# EasyEDA Pro project ProProject_ES120MC1 TO EPDIY 40P_2024-04-23.epro

# Schematic Schematic1
Create Date: 2024-03-15; Page Name: P1; Project Name: ES120MC1 TO EPDIY 40P; Schematic Name: Schematic1; Update Date: 2024-04-12; Company: 嘉立创EDA; Page Size: A4; Version: V1.0
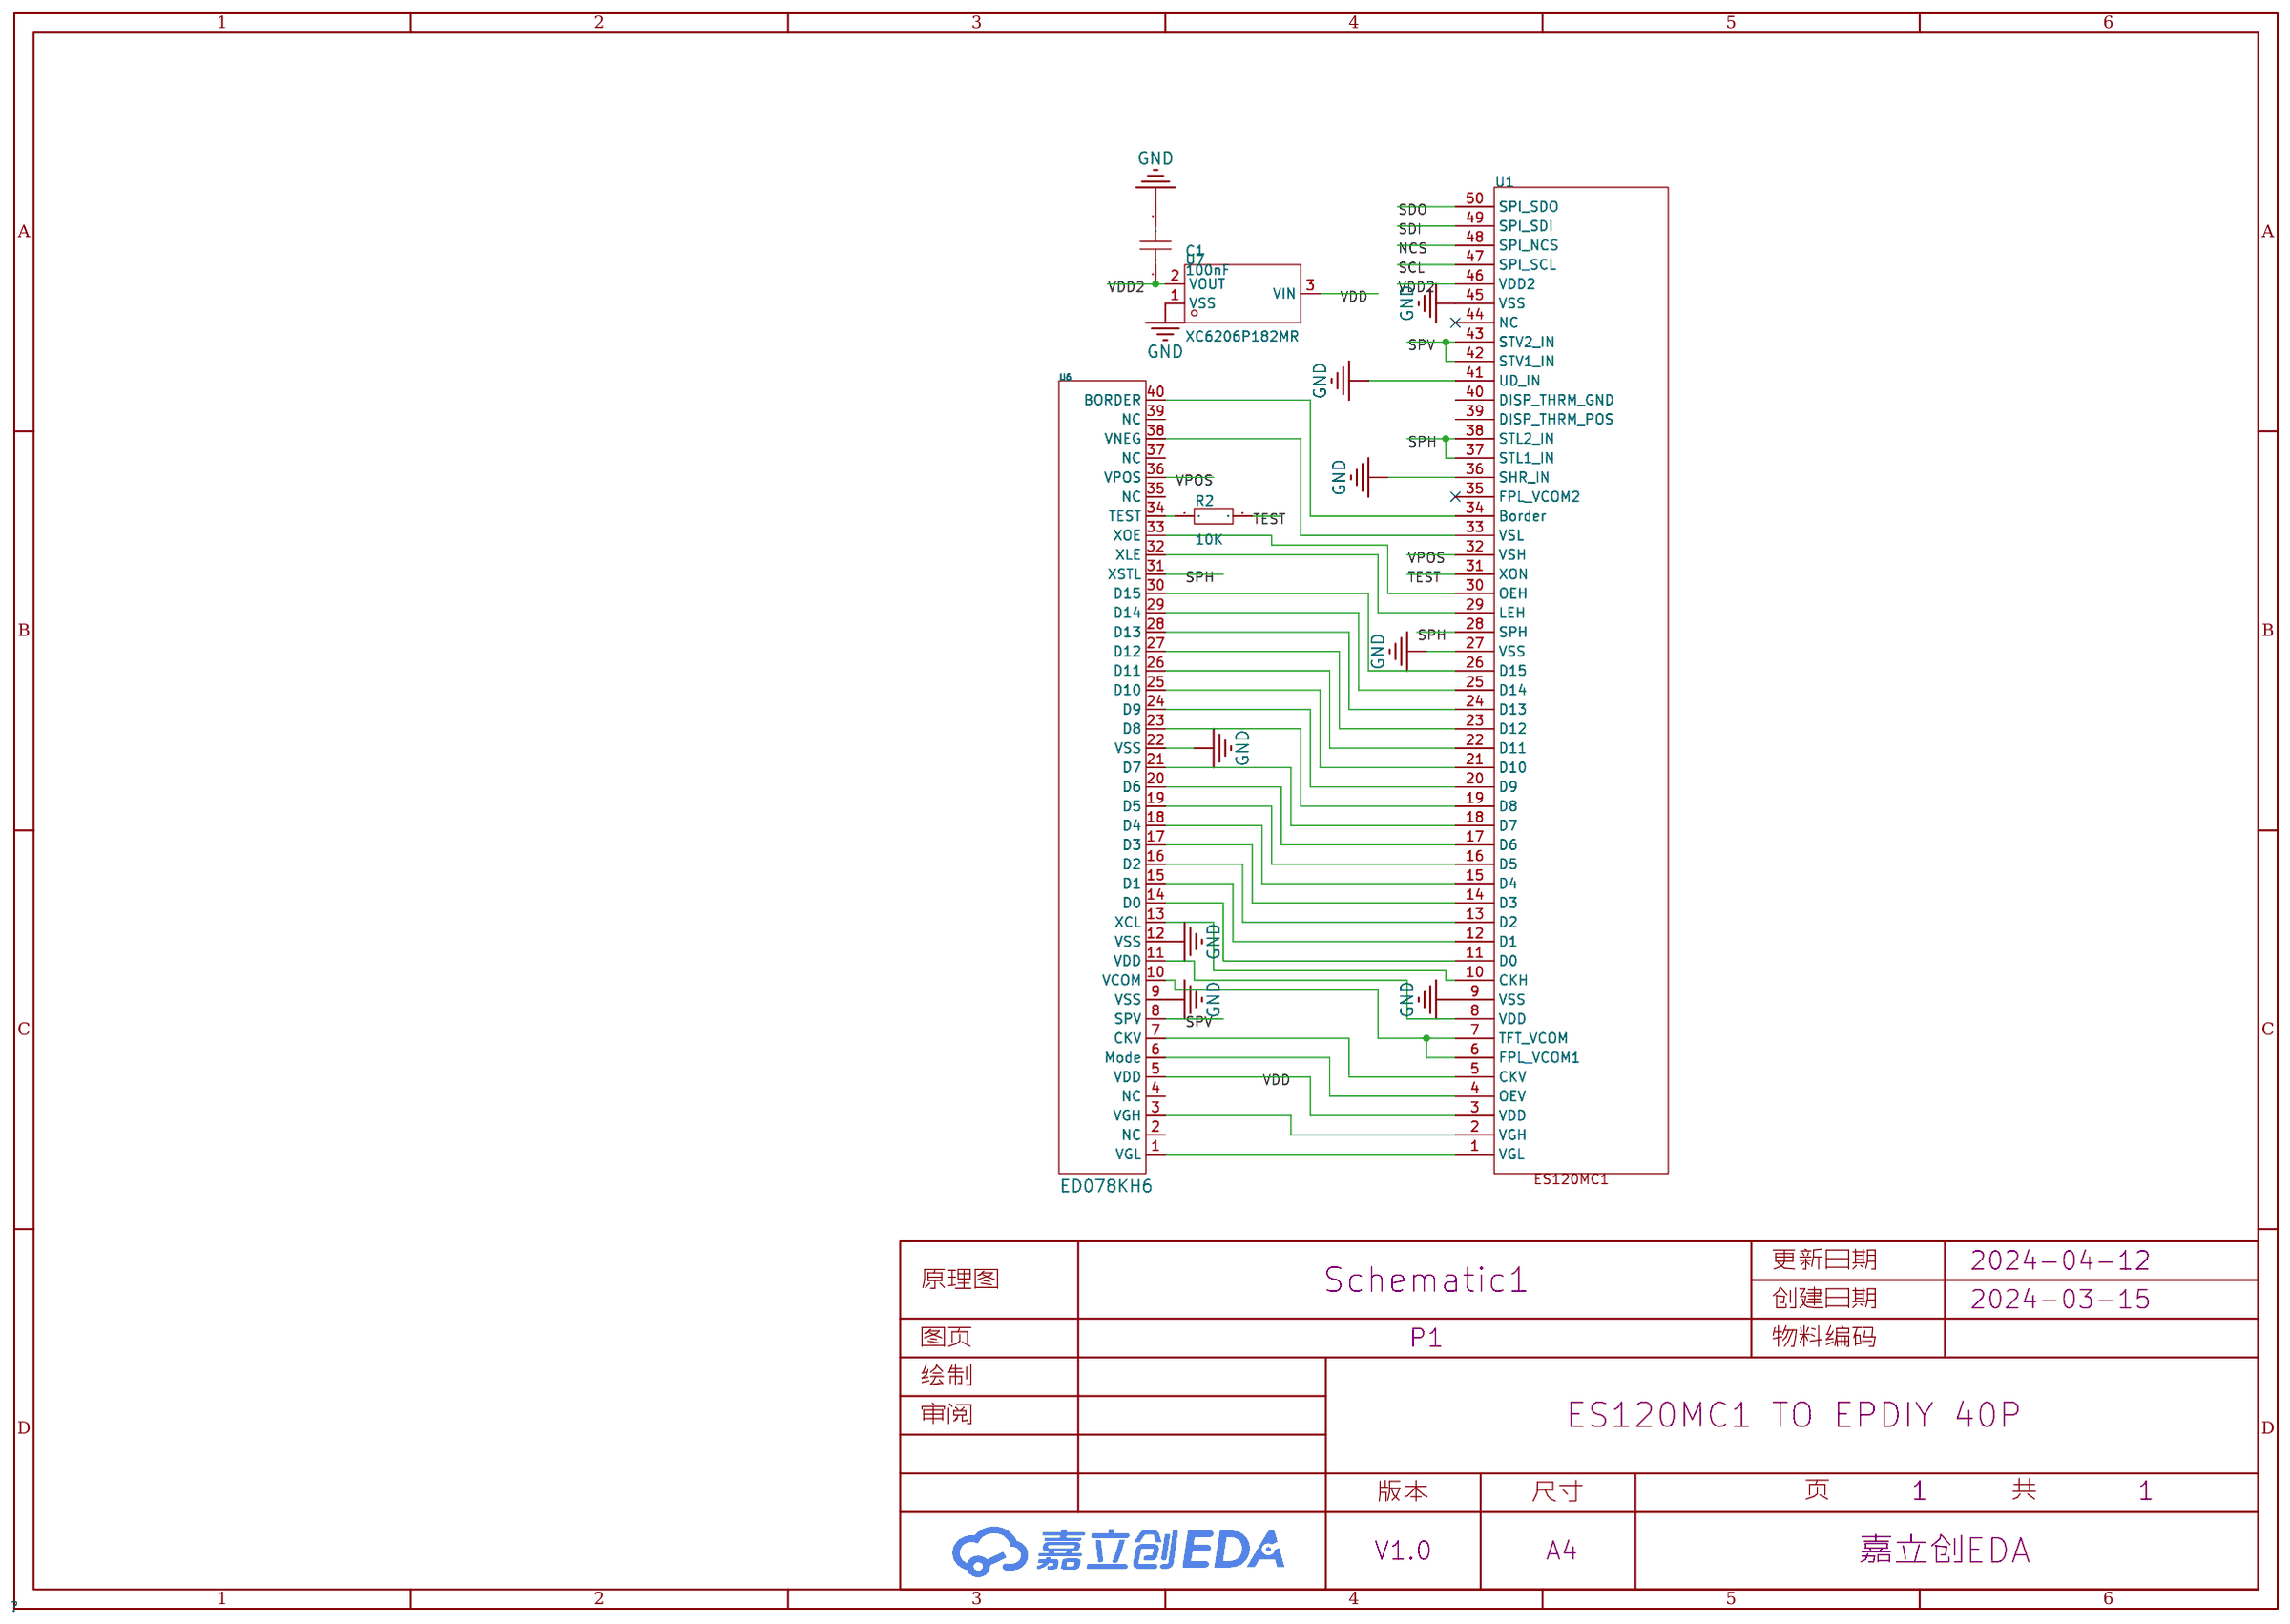
[diagram p0: schematic sheet]

## Parts
C1  100nF  [C0603]
R2  10K  [R0603]
U1  -  [FPC-SMD_FPC-0.5MM-50P]
U6  ED078KH6  [FPC-SMD_40P-P0.50_FG-H2.0-40P]
U7  XC6206P182MR  [SOT-23-3_L3.0-W1.7-P0.95-LS2.9-BR]

## Library data of the parts
C1 = CAP_0603: Supplier Footprint: 0603
R2 = Res_0603: Supplier Footprint: 0603
U1 = ES120MC1
U6 = epdiy_ED078KH6: LCSC: C202114
U7 = XC6206P182MR_C347373: 输出类型:固定;最大输入电压:8V;输出电压:1.8V;最大输出电流:250mA;电源纹波抑制比(PSRR):40dB@(1kHz);输出极性:正极;; LCSC Part Name: 输入8V 输出1.8V 250mA; Supplier Part: C347373; Manufacturer: UMW(友台半导体); Supplier Footprint: SOT-23; JLCPCB Part Class: 扩展库; Datasheet: https://atta.szlcsc.com/upload/public/pdf/source/20231109/6B10DA60E52FC900BF97E3EFEB5D6341.pdf; Supplier: LCSC; Output Type: 固定; Maximum Input Voltage: 8V; Output Voltage: 1.8V; MAX Output Current: 250mA; Power Supply Rejection Ratio (PSRR): 40dB@(1kHz); Dropout Voltage: 280mV@(50mA); Output Polarity: 正极; Number of Outputs: 1

## Nets
GND: C1.1 U1.9(VSS) U1.27(VSS) U1.36(SHR_IN) U1.41(UD_IN) U1.45(VSS) U6.9(VSS) U6.12(VSS) U6.22(VSS) U7.1(VSS)
VDD: U1.3(VDD) U6.5(VDD) U7.3(VIN)
VDD2: C1.2 U1.46(VDD2) U7.2(VOUT)
NCS: U1.48(SPI_NCS)
SCL: U1.47(SPI_SCL)
SDI: U1.49(SPI_SDI)
SDO: U1.50(SPI_SDO)
SPH: U1.28(SPH) U1.37(STL1_IN) U1.38(STL2_IN) U6.31(XSTL)
SPV: U1.42(STV1_IN) U1.43(STV2_IN) U6.8(SPV)
TEST: R2.2 U1.31(XON)
VPOS: U1.32(VSH) U6.36(VPOS)
$1N505: U1.1(VGL) U6.1(VGL)
$1N508: U1.2(VGH) U6.3(VGH)
$1N523: U1.5(CKV) U6.7(CKV)
$1N528: U1.11(D0) U6.14(D0)
$1N533: U1.12(D1) U6.15(D1)
$1N538: U1.13(D2) U6.16(D2)
$1N543: U1.14(D3) U6.17(D3)
$1N548: U1.15(D4) U6.18(D4)
$1N553: U1.16(D5) U6.19(D5)
$1N563: U1.17(D6) U6.20(D6)
$1N573: U1.18(D7) U6.21(D7)
$1N578: U1.19(D8) U6.23(D8)
$1N583: U1.20(D9) U6.24(D9)
$1N588: U1.21(D10) U6.25(D10)
$1N630: U1.22(D11) U6.26(D11)
$1N640: U1.23(D12) U6.27(D12)
$1N650: U1.24(D13) U6.28(D13)
$1N660: U1.25(D14) U6.29(D14)
$1N670: U1.26(D15) U6.30(D15)
$1N675: U1.34(Border) U6.40(BORDER)
$1N704: U1.6(FPL_VCOM1) U1.7(TFT_VCOM) U6.10(VCOM)
$1N725: U1.33(VSL) U6.38(VNEG)
$1N733: U1.29(LEH) U6.32(XLE)
$1N743: U1.30(OEH) U6.33(XOE)
$1N760: R2.1 U6.34(TEST)
$1N960: U1.4(OEV) U6.6(Mode)
$1N965: U1.10(CKH) U6.13(XCL)
$1N1009: U1.8(VDD) U6.11(VDD)

Not connected (* = marked no-connect by the designer): U1 35(FPL_VCOM2)* 39(DISP_THRM_POS) 40(DISP_THRM_GND) 44(NC)*; U6 2(NC) 4(NC) 35(NC) 37(NC) 39(NC)

# Schematic ES120MC1转接_ascii
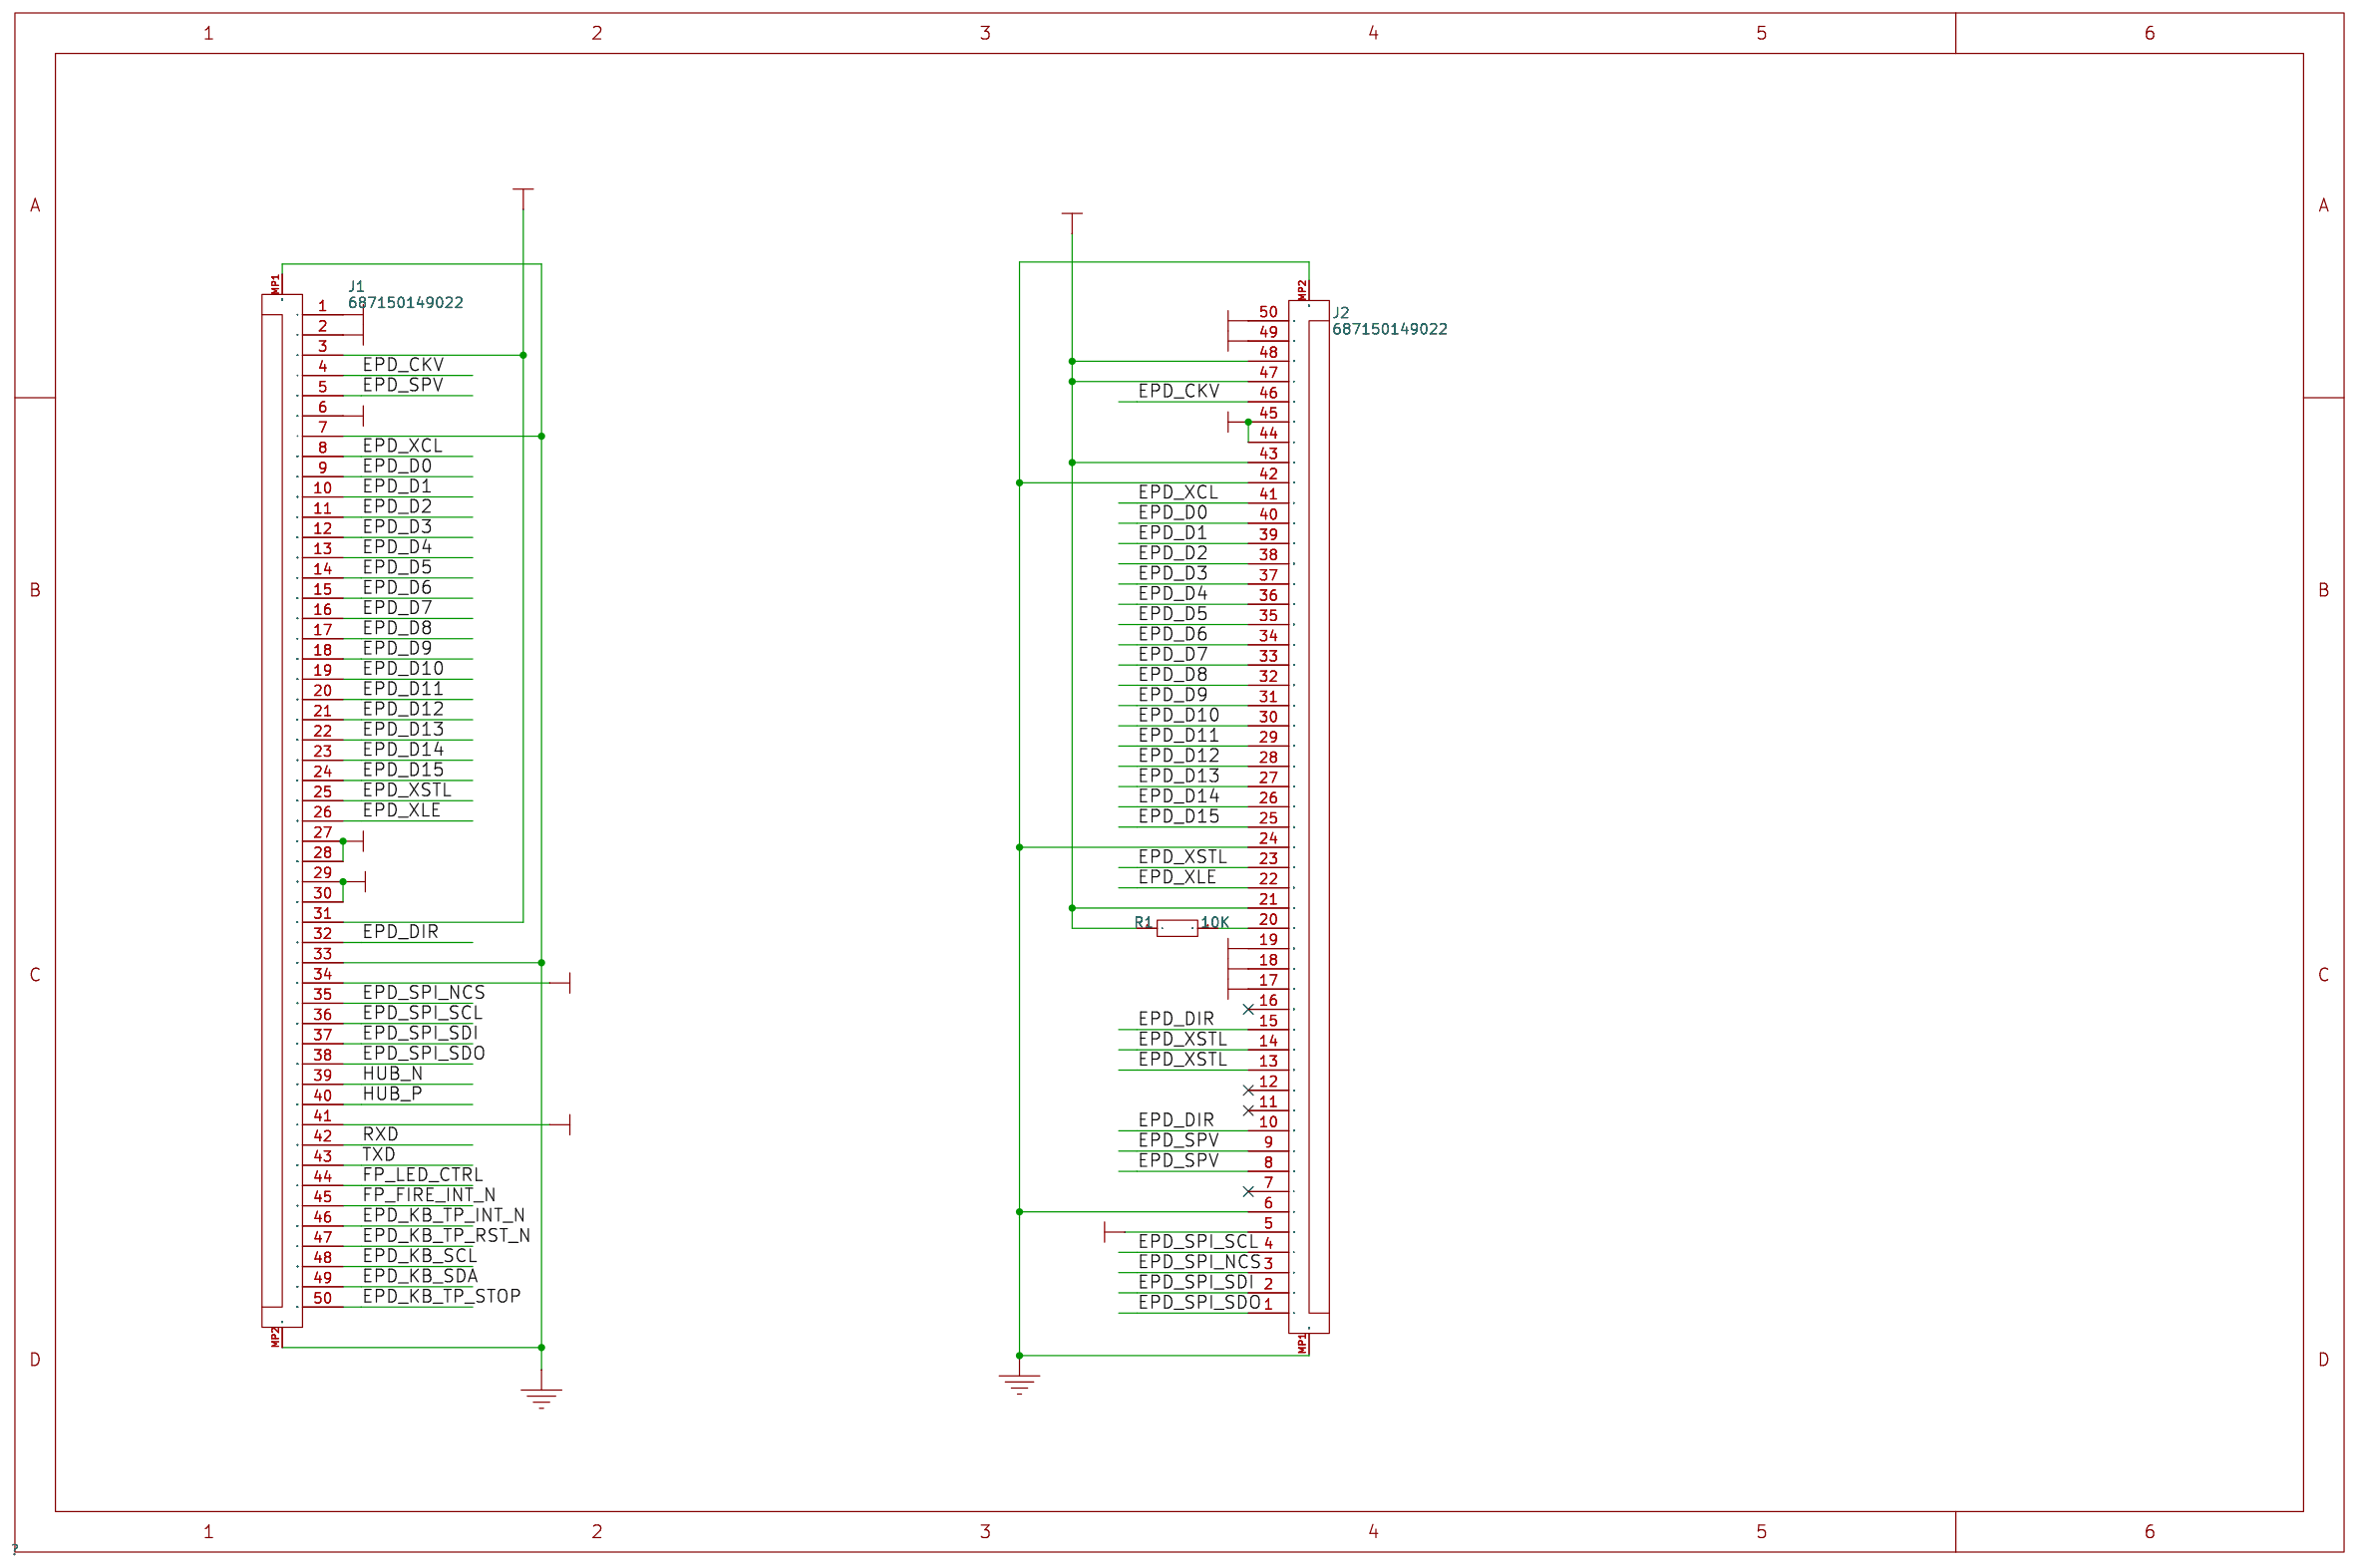
[diagram p1: schematic sheet]

## Parts
J1  687150149022
J2  687150149022
R1  10K

## Library data of the parts
J1 J2 = 687150149022: SMT ZIF Connectors Hinge Type WR-FPC, Horizontal, Bottom Contact, pitch 0.5 mm, 50 pins; Pin Number: 50; Contact Design: BottomContact; Contact Resistance: 50mOhm; Manufacturer: Wurth Elektronik; Working Voltage: 50VAC; Datasheet URL: https://katalog.we-online.de/em/datasheet/687150149022.pdf; Withstanding Voltage: 150VAC; Packaging: TapeandReel; Rated Current: 0.5A; Mounting Technology: SMT; Operating Temperature: -40to105degC; Orientation: Horizontal; Pitch: 0.5mm; Publisher: WurthElektronik; Manufacturer URL: http://www.we-online.de; Design Item ID: CMP-1502-01644-1; Library Name: Altium Content Vault
R1 = 10K: 贴片电阻; BOM名称: 贴片电阻; 联系卖家，免费查找封装: 唯一出售店铺网址https://shop463601444.taobao.com; 封装库来自淘宝卖家ID：黄晶宝石: 其他店铺购入均为盗版假冒封装库，请立即申请退款; Origin Footprint 2: R0201_L; Origin Footprint 3: R0603_L; Origin Footprint 4: R0805_L; Origin Footprint 5: R1206_L; Origin Footprint 6: R1210_L; Origin Footprint 7: R1812_L; Origin Footprint 8: R2010_L; Origin Footprint 9: R2512_L; Origin Footprint 10: R0201_M; Origin Footprint 11: R0402_M; Origin Footprint 12: R0603_M; Origin Footprint 13: R0805_M; Origin Footprint 14: R1206_M; Origin Footprint 15: R1210_M; Origin Footprint 16: R1812_M; Origin Footprint 17: R2010_M; Origin Footprint 18: R2512_M; Origin Footprint 1: R0402_L; Design Item ID: R; Library Name: 0.1 - 电阻-电容-电感-磁珠-电位器

## Nets
GND: J1.7 J1.33 J1.MP1 J1.MP2 J2.6 J2.24 J2.42 J2.MP1 J2.MP2
VCC_1V8: J1.34 J2.5
VCC_3V3: J1.3 J1.31 J2.21 J2.43 J2.47 J2.48 R1.1
VCC_5V: J1.41
EPD_CKV: J1.4 J2.46
EPD_D0: J1.9 J2.40
EPD_D1: J1.10 J2.39
EPD_D2: J1.11 J2.38
EPD_D3: J1.12 J2.37
EPD_D4: J1.13 J2.36
EPD_D5: J1.14 J2.35
EPD_D6: J1.15 J2.34
EPD_D7: J1.16 J2.33
EPD_D8: J1.17 J2.32
EPD_D9: J1.18 J2.31
EPD_D10: J1.19 J2.30
EPD_D11: J1.20 J2.29
EPD_D12: J1.21 J2.28
EPD_D13: J1.22 J2.27
EPD_D14: J1.23 J2.26
EPD_D15: J1.24 J2.25
EPD_DIR: J1.32 J2.10 J2.15
EPD_KB_SCL: J1.48
EPD_KB_SDA: J1.49
EPD_KB_TP_INT_N: J1.46
EPD_KB_TP_RST_N: J1.47
EPD_KB_TP_STOP: J1.50
EPD_SPI_NCS: J1.35 J2.3
EPD_SPI_SCL: J1.36 J2.4
EPD_SPI_SDI: J1.37 J2.2
EPD_SPI_SDO: J1.38 J2.1
EPD_SPV: J1.5 J2.8 J2.9
EPD_VCOM: J1.6 J2.17 J2.44 J2.45
EPD_VEE_-20V: J1.1 J2.50
EPD_VGG_+22V: J1.2 J2.49
EPD_VNEG_-15V: J1.29 J1.30 J2.18
EPD_VPOS_+15V: J1.27 J1.28 J2.19
EPD_XCL: J1.8 J2.41
EPD_XLE: J1.26 J2.22
EPD_XSTL: J1.25 J2.13 J2.14 J2.23
FP_FIRE_INT_N: J1.45
FP_LED_CTRL: J1.44
HUB_N: J1.39
HUB_P: J1.40
RXD: J1.42
TXD: J1.43
Net-(J2-20): J2.20 R1.2

Not connected (* = marked no-connect by the designer): J2 7* 11* 12* 16*

# Board PCB2
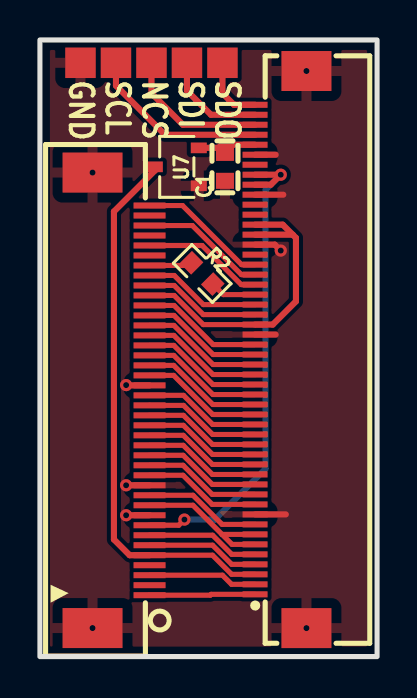
[diagram p2: board, top side]
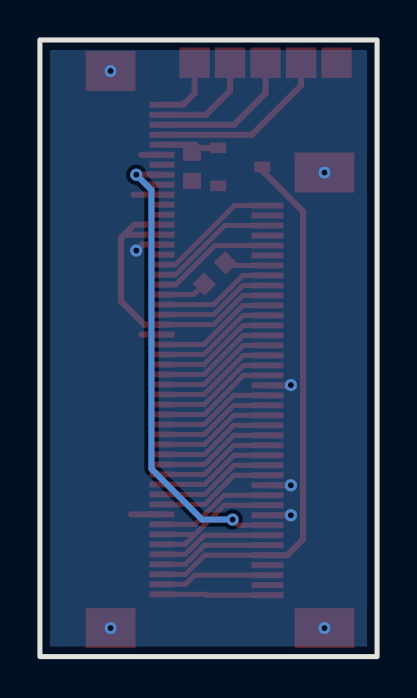
[diagram p3: board, bottom side, seen from below]

Outline 16.89 x 30.86 mm; copper layers: Top Layer, Bottom Layer. Coordinates in mm from the lower left corner of the outline.
Outline path: rectangle 16.89,30.86 0,0
Stack: Top Layer 0.035mm / Dielectric1 1.51mm FR4 er 4.5 / Bottom Layer 0.035mm

## Design rules (mm)
template: 自定义配置
spacing copperThickness1oz (default): track to track 0.102, other pairs 0.152 to 0.3
spacing copperThickness2oz: track to track 0.203, other pairs 0.152 to 0.3
track width copperThickness1oz (default): min 0.127, default 0.254, max 2.54
track width copperThickness2oz: min 0.203, default 0.254, max 2.54
differential pair differentialPair (default): width min 0.127, default 0.254, max 2.54; gap min 0.152, default 0.152
via viaSize (default): diameter min 0.5, default 0.61, max 10; hole min 0.3, default 0.305, max 6.3

## Placement (name value [footprint] x y rotation side)
C1  100nF  [C0603]  9.27 24.51 90 top
NOREF  -  [Pad_e472]  7.37 29.72 270 top
NOREF#2  -  [Pad_e475]  5.59 29.72 270 top
NOREF#3  -  [Pad_e477]  2.03 29.72 270 top
NOREF#4  -  [Pad_e471]  9.14 29.72 270 top
NOREF#5  -  [Pad_e476]  3.81 29.72 270 top
R2  10K  [R0603]  8.13 19.18 315 top
U1  -  [FPC-SMD_FPC-0.5MM-50P]  12.07 15.37 90 top
U6  ED078KH6  [FPC-SMD_40P-P0.50_FG-H2.0-40P]  4.06 12.83 270 top
U7  XC6206P182MR  [SOT-23-3_L3.0-W1.7-P0.95-LS2.9-BR]  6.86 24.51 0 top

## Footprints (pads in the part's own frame, mm; a bottom-side part is the same pattern mirrored in y, then rotated)
C0603
  rect 0.8x0.9 smd: 1(-0.7,0) 2(0.7,0)
FPC-SMD_40P-P0.50_FG-H2.0-40P
  rect 0.3x1.6 smd: 1(9.752,1.428) 2(9.252,1.428) 3(8.752,1.428) 4(8.252,1.428) 5(7.752,1.428) 6(7.252,1.428) 7(6.752,1.428) 8(6.252,1.428) 9(5.752,1.428) 10(5.252,1.428) 11(4.752,1.428) 12(4.252,1.428) 13(3.752,1.428) 14(3.252,1.428) 15(2.752,1.428) 16(2.252,1.428) 17(1.752,1.428) 18(1.252,1.428) 19(0.752,1.428) 20(0.252,1.428) 21(-0.248,1.428) 22(-0.748,1.428) 23(-1.248,1.428) 24(-1.748,1.428) 25(-2.248,1.428) 26(-2.748,1.428) 27(-3.248,1.428) 28(-3.748,1.428) 29(-4.248,1.428) 30(-4.748,1.428) 31(-5.248,1.428) 32(-5.748,1.428) 33(-6.248,1.428) 34(-6.748,1.428) 35(-7.248,1.428) 36(-7.748,1.428) 37(-8.248,1.428) 38(-8.748,1.428) 39(-9.248,1.428) 40(-9.748,1.428)
  rect 2x3 smd: 41(-11.398,-1.428) 42(11.398,-1.428)
FPC-SMD_FPC-0.5MM-50P
  rect 0.3x1.25 smd: 1(-12.25,1.288) 2(-11.75,1.288) 3(-11.25,1.288) 4(-10.75,1.288) 5(-10.25,1.288) 6(-9.75,1.288) 7(-9.25,1.288) 8(-8.75,1.288) 9(-8.25,1.288) 10(-7.75,1.288) 11(-7.25,1.288) 12(-6.75,1.288) 13(-6.25,1.288) 14(-5.75,1.288) 15(-5.25,1.288) 16(-4.75,1.288) 17(-4.25,1.288) 18(-3.75,1.288) 19(-3.25,1.288) 20(-2.75,1.288) 21(-2.25,1.288) 22(-1.75,1.288) 23(-1.25,1.288) 24(-0.75,1.288) 25(-0.25,1.288) 26(0.25,1.288) 27(0.75,1.288) 28(1.25,1.288) 29(1.75,1.288) 30(2.25,1.288) 31(2.75,1.288) 32(3.25,1.288) 33(3.75,1.288) 34(4.25,1.288) 35(4.75,1.288) 36(5.25,1.288) 37(5.75,1.288) 38(6.25,1.288) 39(6.75,1.288) 40(7.25,1.288) 41(7.75,1.288) 42(8.25,1.288) 43(8.75,1.288) 44(9.25,1.288) 45(9.75,1.288) 46(10.25,1.288) 47(10.75,1.288) 48(11.25,1.288) 49(11.75,1.288) 50(12.25,1.288)
  rect 2x2.5 smd: 51(13.94,-1.288) 52(-13.94,-1.288)
Pad_e471
  rect 1.524x1.524 smd: 53(0,0)
Pad_e472
  rect 1.524x1.524 smd: 54(0,0)
Pad_e475
  rect 1.524x1.524 smd: 54(0,0)
Pad_e476
  rect 1.524x1.524 smd: 55(0,0)
Pad_e477
  rect 1.524x1.524 smd: 56(0,0)
R0603
  rect 0.806x0.864 smd: 1(-0.753,0) 2(0.753,0)
SOT-23-3_L3.0-W1.7-P0.95-LS2.9-BR
  rect 0.8x0.532 smd: 1(1.101,-0.95) 2(1.101,0.95) 3(-1.101,0)

## Nets
As in the schematic, except:
GND: C1.1 NOREF#3.56 U1.9 U1.27 U1.36 U1.41 U1.45 U1.51 U1.52 U6.9 U6.12 U6.22 U6.41 U6.42 U7.1
NCS: NOREF#2.54 U1.48
SCL: NOREF#5.55 U1.47
SDI: NOREF.54 U1.49
SDO: NOREF#4.53 U1.50

Pads without a net: U1 35 39 40 44; U6 2 4 35 37 39

## Via types
v1: diameter 0.61, hole 0.305, Top Layer to Bottom Layer, 10 vias

## Routing (per net, layer and track width the routed paths; a pad name or vN(x,y) marks a point on that pad's centre or on a via; arc(x,y) is an arc through that point)
GND: length 10
  Top Layer w0.305: U1.9 12.32,7.12 ; U1.45 11.81,25.12 ; U1.27 11.81,16.12 ; v1(12.07,20.32) 11.77,20.62 U1.36 ; U1.41 12.19,23.12 ; U6.22 4.33,13.58 v1(4.32,13.59) ; U6.12 v1(4.32,8.58) ; U6.9 v1(4.32,7.08)
  vias: v1(2.64,24.22) v1(2.64,1.43) v1(13.35,29.31) v1(13.35,1.43)
VDD: length 27.3
  Top Layer w0.254: U6.5 8.65,5.08 9.6,4.12 U1.3
  Top Layer w0.305: U7.3 5.76,24.32 3.71,22.28 3.71,5.86 4.5,5.08 U6.5
VDD2: length 2.9
  Top Layer w0.305: U7.2 8.95,25.46 9.11,25.62 U1.46
NCS: length 7.4
  Top Layer w0.305: NOREF#2.54 5.59,28.19 7.17,26.62 U1.48
SCL: length 9.1
  Top Layer w0.305: U1.47 6.27,26.12 3.81,28.58 NOREF#5.55
SDI: length 5.3
  Top Layer w0.305: NOREF.54 7.37,28.32 8.57,27.12 U1.49
SDO: length 3.4
  Top Layer w0.305: NOREF#4.53 9.14,28.19 9.72,27.62 U1.50
SPH: length 15.8
  Top Layer w0.254: U1.28 8.18,16.62 6.72,18.08 U6.31
  Top Layer w0.305: 12.67,21.12 12.17,21.62 U1.38 ; 12.67,21.12 U1.37 ; 12.67,21.12 12.83,20.95 12.83,17.78 11.66,16.62 U1.28
SPV: length 24.8
  Top Layer w0.254: U6.8 6.96,6.58 v1(7.24,6.86)
  Top Layer w0.305: U1.43 v1(12.07,24.12) 11.57,23.62 U1.42
  Bottom Layer w0.305: v1(7.24,6.86) 8.76,6.86 11.3,9.4 11.3,23.36 v1(12.07,24.12)
TEST: length 2.3
  Top Layer w0.254: R2.2 9.19,18.12 U1.31
VPOS: length 6.1
  Top Layer w0.254: U1.32 10.09,18.62 8.13,20.58 U6.36
$1N505: length 5.3
  Top Layer w0.254: U6.1 8.54,3.08 8.58,3.12 U1.1
$1N508: length 5.5
  Top Layer w0.254: U6.3 9.14,4.08 9.6,3.62 U1.2
$1N523: length 5.7
  Top Layer w0.254: U1.5 9.61,5.12 8.65,6.08 U6.7
$1N528: length 5.9
  Top Layer w0.254: U6.14 7.17,9.58 8.63,8.12 U1.11
$1N533: length 5.9
  Top Layer w0.254: U6.15 7.18,10.08 8.64,8.62 U1.12
$1N538: length 5.9
  Top Layer w0.254: U1.13 8.64,9.12 7.18,10.58 U6.16
$1N543: length 5.9
  Top Layer w0.254: U6.17 7.18,11.08 8.64,9.62 U1.14
$1N548: length 5.9
  Top Layer w0.254: U6.18 7.19,11.58 8.65,10.12 U1.15
$1N553: length 5.9
  Top Layer w0.254: U6.19 7.19,12.08 8.65,10.62 U1.16
$1N563: length 5.9
  Top Layer w0.254: U1.17 8.65,11.12 7.19,12.57 5.49,12.57 U6.20
$1N573: length 5.9
  Top Layer w0.254: U1.18 8.65,11.62 7.2,13.08 U6.21
$1N578: length 6.1
  Top Layer w0.254: U6.23 6.7,14.08 8.66,12.12 U1.19
$1N583: length 6.1
  Top Layer w0.254: U6.24 6.7,14.58 8.66,12.62 U1.20
$1N588: length 6.1
  Top Layer w0.254: U1.21 8.66,13.12 6.7,15.08 U6.25
$1N630: length 6.1
  Top Layer w0.254: U1.22 8.67,13.62 6.71,15.58 U6.26
$1N640: length 6.1
  Top Layer w0.254: U6.27 6.71,16.08 8.67,14.12 U1.23
$1N650: length 6.1
  Top Layer w0.254: U1.24 8.67,14.62 6.71,16.58 U6.28
$1N660: length 6.1
  Top Layer w0.254: U6.29 6.72,17.08 8.67,15.12 U1.25
$1N670: length 6.1
  Top Layer w0.254: U6.30 6.72,17.58 8.68,15.62 U1.26
$1N675: length 6.5
  Top Layer w0.254: U1.34 10.1,19.62 7.14,22.57 U6.40
$1N704: length 7.8
  Top Layer w0.254: 9.12,6.12 7.67,7.58 U6.10 ; 9.12,6.12 U1.7 ; 9.12,6.12 9.62,5.62 U1.6
$1N725: length 6.3
  Top Layer w0.254: U6.38 7.64,21.58 10.09,19.12 U1.33
$1N733: length 5.9
  Top Layer w0.254: U1.29 8.18,17.12 6.73,18.58 U6.32
$1N743: length 5.9
  Top Layer w0.254: U6.33 6.73,19.08 8.19,17.62 U1.30
$1N760: length 2.2
  Top Layer w0.254: R2.1 7.46,19.58 U6.34
$1N960: length 5.7
  Top Layer w0.254: U1.4 9.61,4.62 8.65,5.58 U6.6
$1N965: length 5.9
  Top Layer w0.254: U6.13 7.17,9.08 8.63,7.62 U1.10
$1N1009: length 5.9
  Top Layer w0.254: U6.11 7.67,8.08 9.13,6.62 U1.8

## Copper pours and planes (outline as drawn; the poured copper is in the pictures)
GND on Top Layer: 17.4,31.37 17.4,-0.64 -0.51,-0.64 -0.51,31.37
GND on Bottom Layer: 18.16,31.88 18.16,-1.27 -1.02,-1.27 -1.02,31.88

## Text on the board
Top Silkscreen Layer: SDO / SDI / NCS / SCL / GND
